# EAGLE schematic 1.a.i.1_bench-battery-grid (EAGLE 7.1.0)
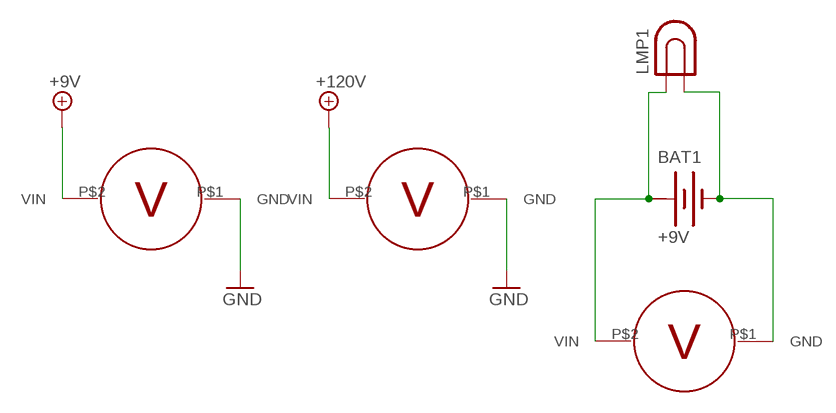
[diagram p0: schematic, sheet 1]

## Parts
BAT1  +9V  BATTERY  [BATTERY]
LMP1  LAMP  [LDH-5R]
U$1  VOLTMETER  [VOLTMETER]
U$2  VOLTMETER  [VOLTMETER]
U$3  VOLTMETER  [VOLTMETER]

## Nets
N$1: BAT1.+ LMP1.1
N$2: BAT1.- LMP1.2
Unconnected: U$1.P$1(GND) U$1.P$2(VIN) U$2.P$1(GND) U$2.P$2(VIN) U$3.P$1(GND) U$3.P$2(VIN)

## Power pins joined to a net without a drawn wire
+: BAT1.+@1(+)

## Library data of the parts
BAT1 = special:BATTERY: BATTERY
LMP1 = special:LAMP: LED HOLDER
U$1-U$3 = voltmeter:VOLTMETER